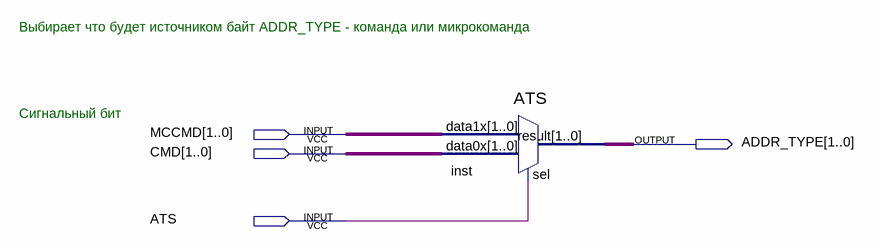
[diagram p0: schematic sheet]
// Quartus schematic ADDR_TYPE_SW.bdf as structural Verilog: 1 symbols, 4 pins
module ADDR_TYPE_SW (
  input  [1:0] MCCMD,
  input  [1:0] CMD,
  input  ATS,
  output [1:0] ADDR_TYPE
);

  ATS inst (.data1x(MCCMD), .data0x(CMD), .sel(ATS), .result(ADDR_TYPE));

  // Notes on the sheet:
  //   Выбирает что будет источником байт ADDR_TYPE - команда или микрокоманда
  //   Сигнальный бит
endmodule
